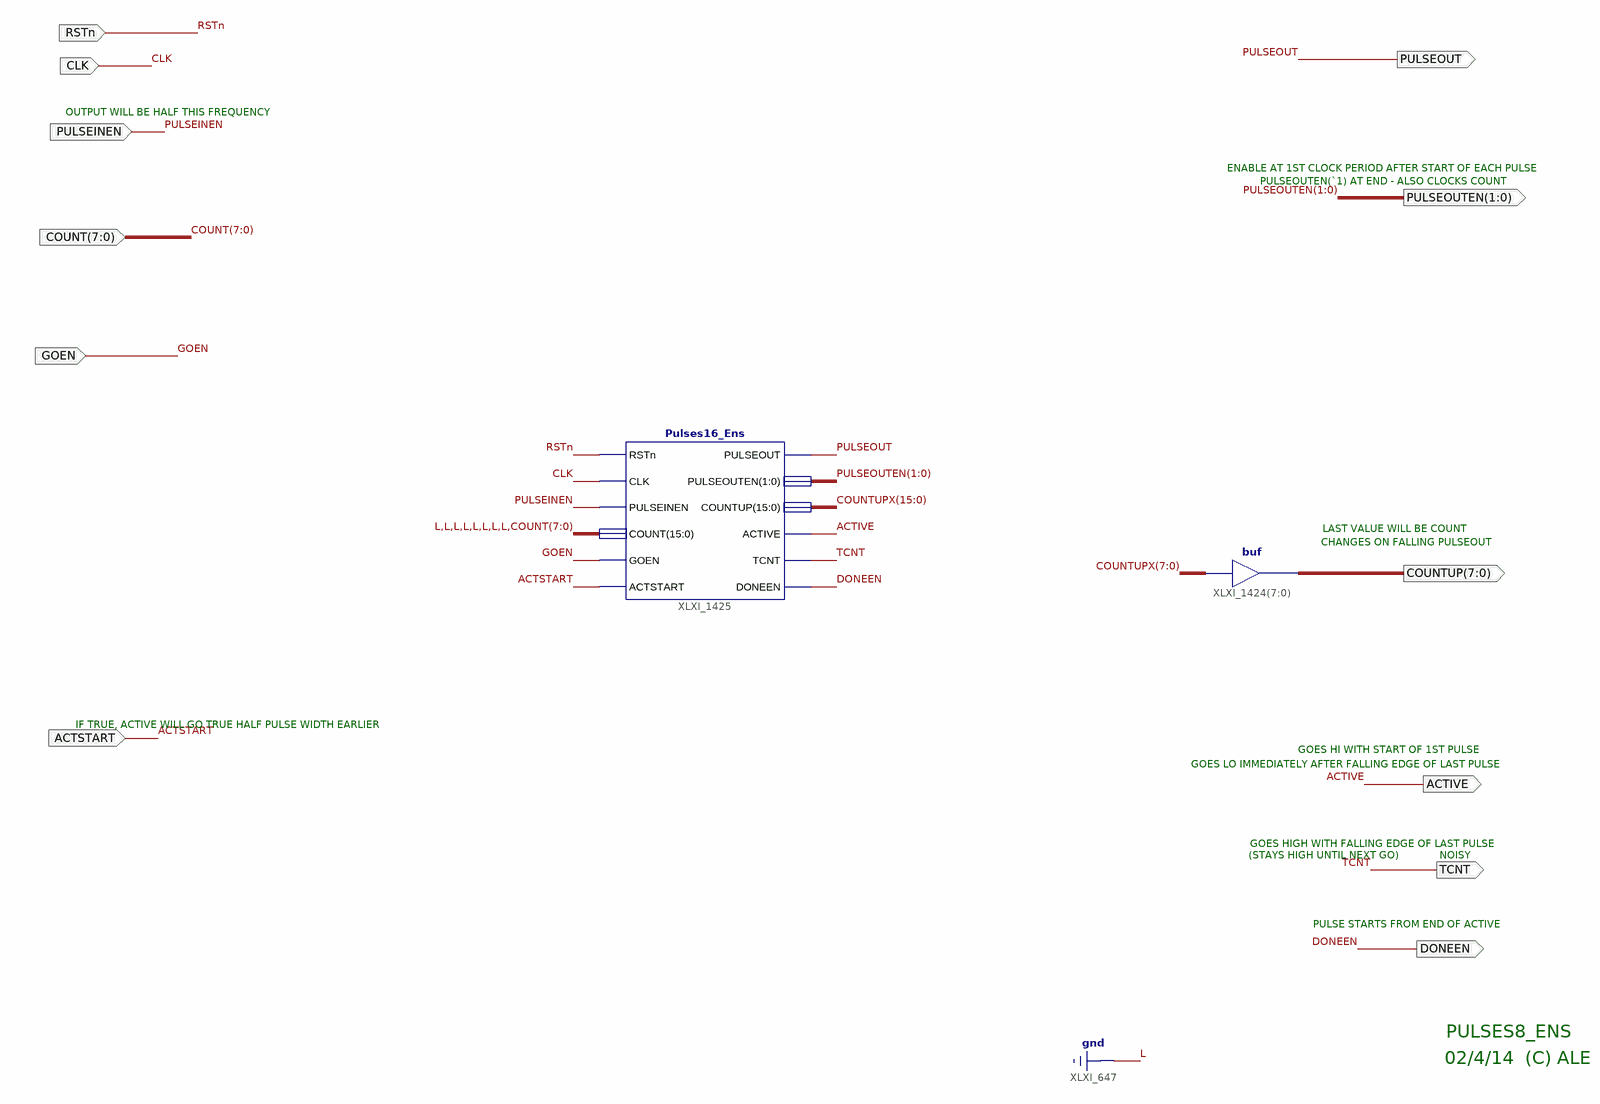
[diagram p0: schematic sheet 1]
// Xilinx ISE schematic Pulses8_Ens.sch (spartan3e) as structural Verilog: 2 symbols, 12 ports
module Pulses8_Ens (
  input  RSTn,
  input  CLK,
  input  GOEN,
  input  PULSEINEN,
  input  [7:0] COUNT,
  input  ACTSTART,
  output ACTIVE,
  output TCNT,
  output PULSEOUT,
  output [1:0] PULSEOUTEN,
  output [7:0] COUNTUP,
  output DONEEN
);

  wire [15:0] COUNTUPX;

  assign COUNTUP = COUNTUPX[7:0];  // buf XLXI_1424[7..0], 8 bits wide
  Pulses16_Ens XLXI_1425 (
    .ACTIVE(ACTIVE), .ACTSTART(ACTSTART), .CLK(CLK), .COUNT({{8{1'b0}}, COUNT}), .COUNTUP(COUNTUPX),
    .DONEEN(DONEEN), .GOEN(GOEN), .PULSEINEN(PULSEINEN), .PULSEOUT(PULSEOUT), .PULSEOUTEN(PULSEOUTEN),
    .RSTn(RSTn), .TCNT(TCNT));

  // Notes on the sheet:
  //   OUTPUT WILL BE HALF THIS FREQUENCY
  //   ENABLE AT 1ST CLOCK PERIOD AFTER START OF EACH PULSE
  //   PULSEOUTEN(`1) AT END - ALSO CLOCKS COUNT
  //   LAST VALUE WILL BE COUNT
  //   CHANGES ON FALLING PULSEOUT
  //   IF TRUE, ACTIVE WILL GO TRUE HALF PULSE WIDTH EARLIER
  //   GOES HI WITH START OF 1ST PULSE
  //   GOES LO IMMEDIATELY AFTER FALLING EDGE OF LAST PULSE
  //   GOES HIGH WITH FALLING EDGE OF LAST PULSE
  //   (STAYS HIGH UNTIL NEXT GO)
  //   NOISY
  //   PULSE STARTS FROM END OF ACTIVE
  //   PULSES8_ENS
  //   02/4/14  (C) ALE
endmodule
